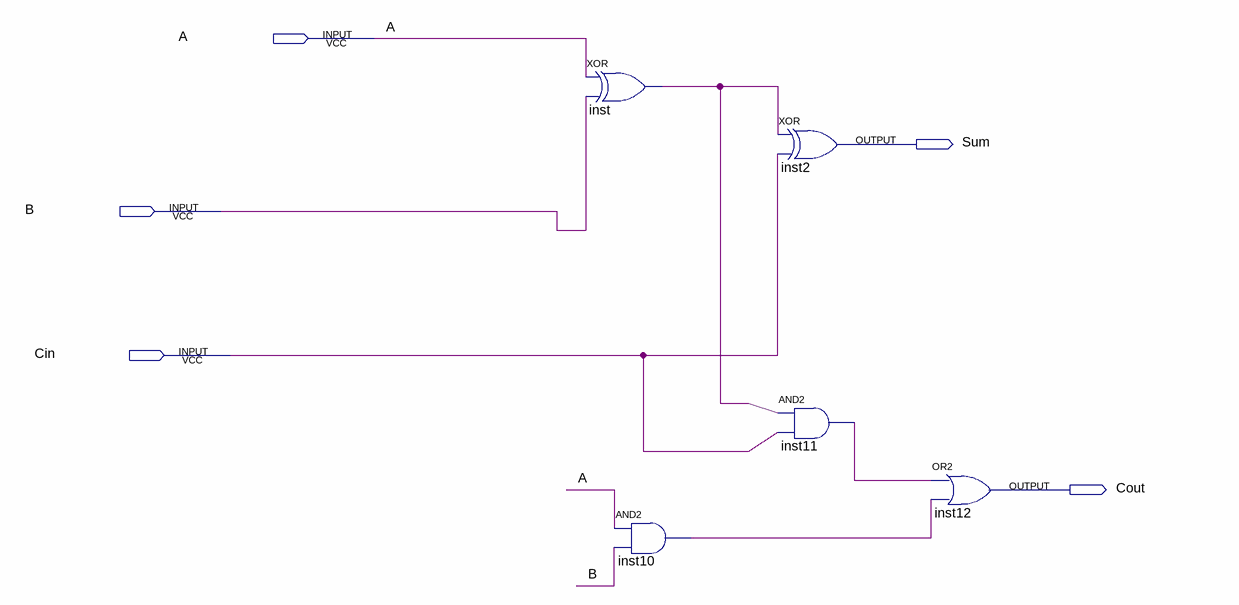
[diagram p0: schematic sheet]
// Quartus schematic 1bitAdder.bdf as structural Verilog: 5 symbols, 5 pins
module \1bitAdder  (
  input  A,
  input  B,
  input  Cin,
  output Sum,
  output Cout
);

  wire inst10_out, inst11_out, inst_out;

  xor inst (inst_out, A, B);
  and inst10 (inst10_out, A, B);
  xor inst2 (Sum, inst_out, Cin);
  and inst11 (inst11_out, inst_out, Cin);
  or inst12 (Cout, inst11_out, inst10_out);
endmodule
